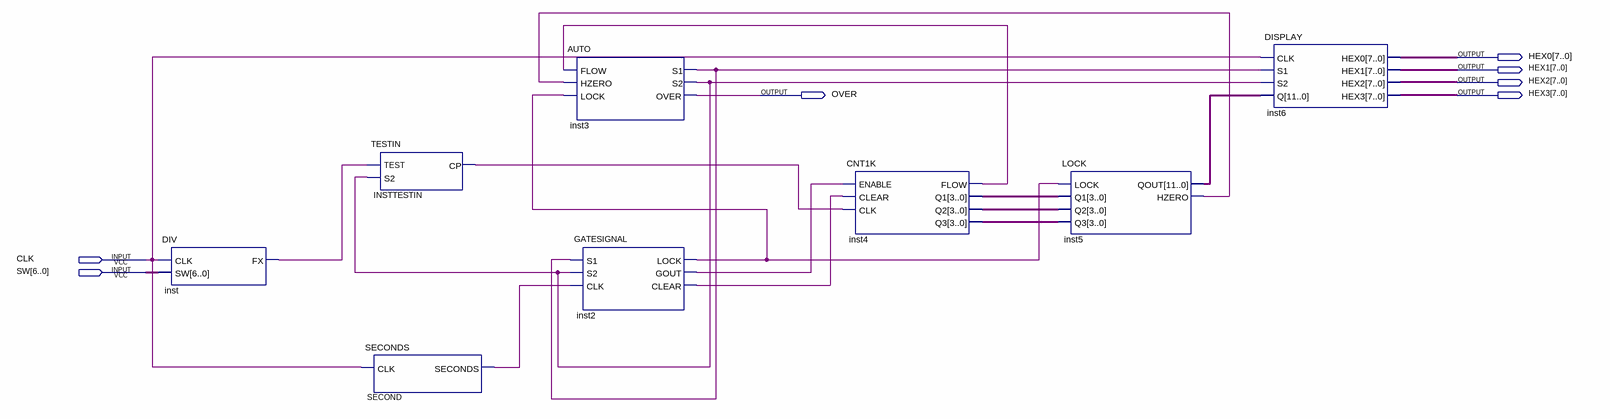
[diagram p0: schematic sheet]
// Quartus schematic frequency_meter_pro.bdf as structural Verilog: 8 symbols, 7 pins
module frequency_meter_pro (
  input  CLK,
  input  [6:0] SW,
  output [7:0] HEX0,
  output [7:0] HEX1,
  output [7:0] HEX2,
  output OVER,
  output [7:0] HEX3
);

  wire inst2_clear, inst2_gout, inst2_lock, inst3_s1, inst3_s2, inst4_flow, inst5_hzero, inst_fx,
       INSTTESTIN_cp, SECOND_seconds;
  wire [3:0] inst4_q1, inst4_q2, inst4_q3;
  wire [11:0] inst5_qout;

  DIV inst (.CLK(CLK), .SW(SW), .FX(inst_fx));
  SECONDS SECOND (.CLK(CLK), .SECONDS(SECOND_seconds));
  TESTIN INSTTESTIN (.TEST(inst_fx), .S2(inst3_s2), .CP(INSTTESTIN_cp));
  AUTO inst3 (.FLOW(inst4_flow), .HZERO(inst5_hzero), .LOCK(inst2_lock), .S1(inst3_s1), .S2(inst3_s2), .OVER(OVER));
  GATESIGNAL inst2 (
    .S1(inst3_s1), .S2(inst3_s2), .CLK(SECOND_seconds), .LOCK(inst2_lock), .GOUT(inst2_gout),
    .CLEAR(inst2_clear));
  CNT1K inst4 (
    .ENABLE(inst2_gout), .CLEAR(inst2_clear), .CLK(INSTTESTIN_cp), .FLOW(inst4_flow), .Q1(inst4_q1),
    .Q2(inst4_q2), .Q3(inst4_q3));
  LOCK inst5 (.LOCK(inst2_lock), .Q1(inst4_q1), .Q2(inst4_q2), .Q3(inst4_q3), .QOUT(inst5_qout), .HZERO(inst5_hzero));
  DISPLAY inst6 (
    .CLK(CLK), .S1(inst3_s1), .S2(inst3_s2), .Q(inst5_qout), .HEX0(HEX0), .HEX1(HEX1), .HEX2(HEX2),
    .HEX3(HEX3));
endmodule
